# Altium schematic sheet LOGIC_SUPPLY.SchDoc
size A4; SheetNumber: 13; SheetTotal: 17
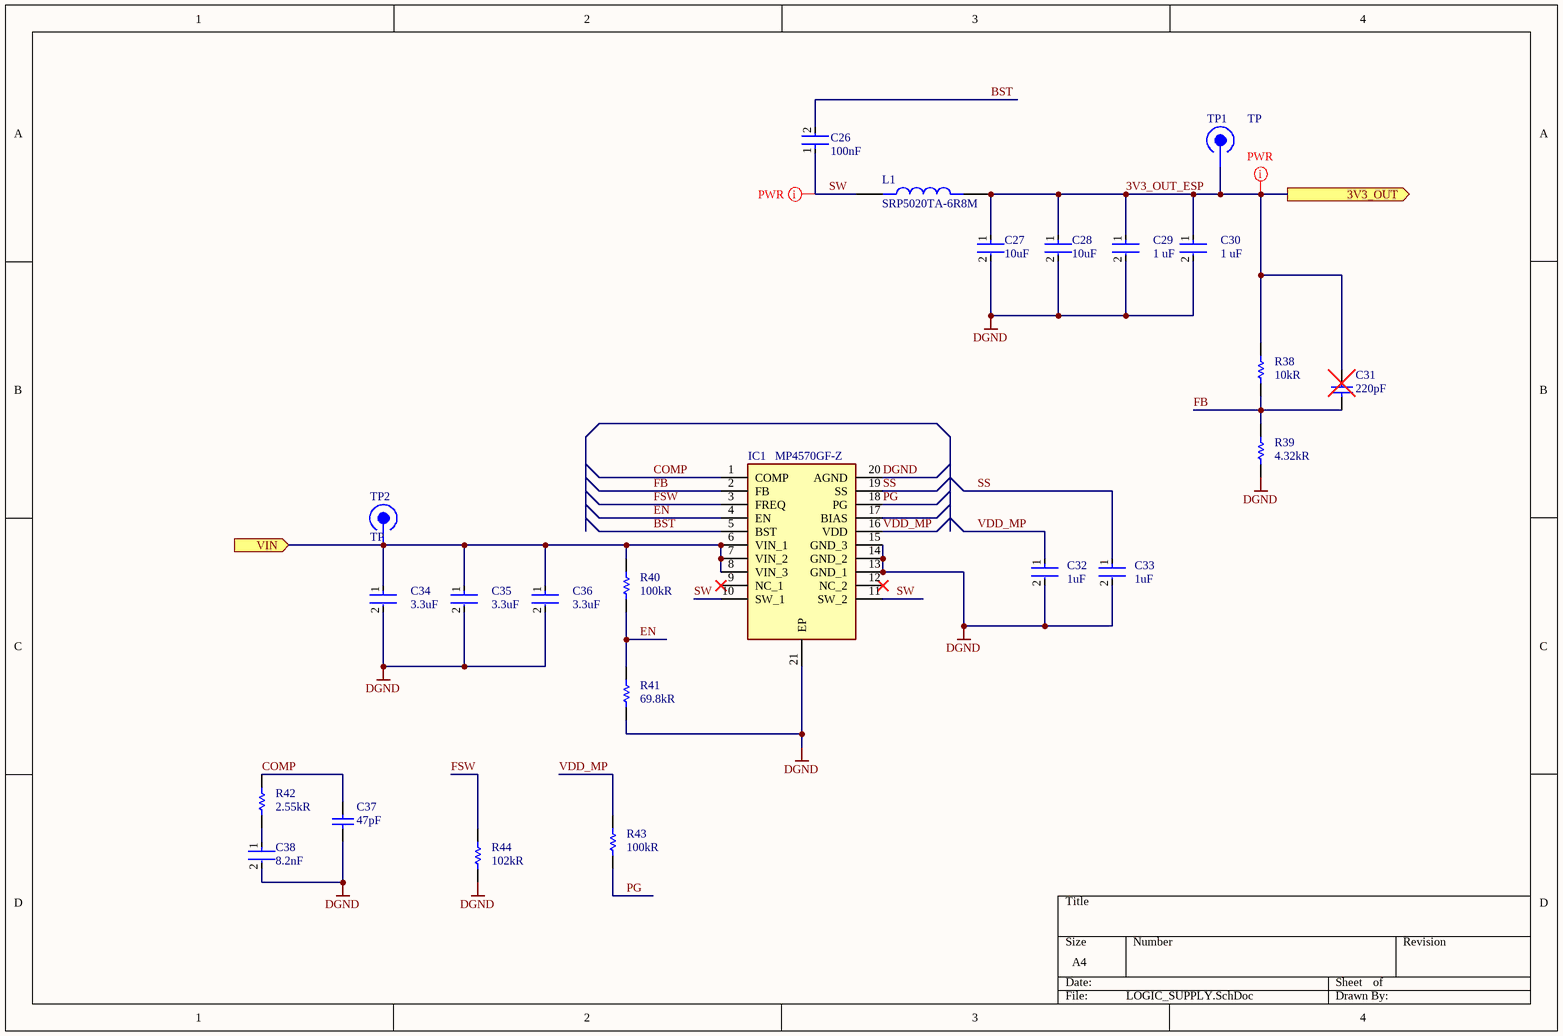
[diagram p0: LOGIC_SUPPLY.SchDoc]

## Parts
C26  value 100nF  [FP-CC0402-IPC_B]  (hidden comment: CC0402KRX7R9BB104)
C27  value 10uF  [FP-GRM21B-0_15-MFG]  (hidden comment: GRM21BR71A106KA73L)
C28  value 10uF  [FP-GRM21B-0_15-MFG]  (hidden comment: GRM21BR71A106KA73L)
C29  value 1 uF  [FP-CC0402-MFG]  (hidden comment: CC0402KRX5R6BB105)
C30  value 1 uF  [FP-CC0402-MFG]  (hidden comment: CC0402KRX5R6BB105)
C31  value 220pF  [CAPC1005X55X25LL05T10]  (hidden comment: GRM1555C1H221GA01J)  (no BOM)
C32  Capacitance: 1uF  [FP-GRM155-0_05-IPC_B]  (hidden comment: GRM155R61E105KA12D)
C33  Capacitance: 1uF  [FP-GRM155-0_05-IPC_B]  (hidden comment: GRM155R61E105KA12D)
C34  value 3.3uF  [FP-C2012-125-0_2-MFG]  (hidden comment: C2012X7R1E335K125AB)
C35  value 3.3uF  [FP-C2012-125-0_2-MFG]  (hidden comment: C2012X7R1E335K125AB)
C36  value 3.3uF  [FP-C2012-125-0_2-MFG]  (hidden comment: C2012X7R1E335K125AB)
C37  value 47pF  [CAPC1005X55X25LL05T10]  (hidden comment: GRM1555C1H470GA01D)
C38  value 8.2nF  [FP-GRM155-0_15-IPC_C]  (hidden comment: GRM1555C1H822JE01D)
IC1  MP4570GF-Z  [MP4570GF-Z-Footprint-1]
L1  SRP5020TA-6R8M  [SRP5020TA-6R8M-Footprint-1]
R38  value 10kR  [RESC1005X40X25LL10T10]  (hidden comment: RK73H1ETTP1002F)
R39  value 4.32kR  [RESC1005X40X25LL10T10]  (hidden comment: RK73H1ETTP4321F)
R40  value 100kR  [RESC1005X40X25NL10T10]  (hidden comment: RK73H1ETTP1003F)
R41  value 69.8kR  [RESC1005X40X25NL10T10]  (hidden comment: RK73H1ETTP6982F)
R42  value 2.55kR  [RESC1005X40X25ML10T10]  (hidden comment: RK73H1ETTP2551F)
R43  value 100kR  [RESC1005X40X25LL10T10]  (hidden comment: RK73H1ETTP1003F)
R44  value 102kR  [RESC1005X40X25ML10T10]  (hidden comment: RK73H1ETTP1023F)
TP1  TP  [TP-Footprint-1]
TP2  TP  [TP-Footprint-1]

## Ports
3V3_OUT (out), VIN (in)

## Nets
DGND: C27.2 C28.2 C29.2 C30.2 C32.2 C33.2 C34.2 C35.2 C36.2 C37.1 C38.2 IC1.13(GND_1) IC1.14(GND_2) IC1.15(GND_3) IC1.20(AGND) IC1.21(EP) R39.1 R41.1 R44.1
3V3_OUT_ESP: C27.1 C28.1 C29.1 C30.1 C31.2 L1.2 R38.2 TP1.1 ; port 3V3_OUT
BST: C26.2 IC1.5(BST)
COMP: C37.2 IC1.1(COMP) R42.2
EN: IC1.4(EN) R40.1 R41.2
FB: C31.1 IC1.2(FB) R38.1 R39.2
FSW: IC1.3(FREQ) R44.2
PG: IC1.18(PG) R43.1
SS: C33.1 IC1.19(SS)
SW: C26.1 IC1.10(SW_1) IC1.11(SW_2) L1.1
VDD_MP: C32.1 IC1.16(VDD) R43.2
VIN: C34.1 C35.1 C36.1 IC1.6(VIN_1) IC1.7(VIN_2) IC1.8(VIN_3) R40.2 TP2.1 ; port VIN
NetC38_1: C38.1 R42.1

Not connected (* = marked no-connect by the designer): IC1 9(NC_1)* 12(NC_2)* 17(BIAS)

## Layout directives
net class PWR: 3V3_OUT_ESP, SW

## Library data of the parts
C26 = CMP-x00152-1: Ceramic Capacitor, Multilayer, Ceramic, 50V, 10% +Tol, 10% -Tol, X7R, 15% TC, 0.1uF, Surface Mount, 0402
C27 C28 = CMP-x00157-1: Ceramic Capacitor, Multilayer, Ceramic, 10V, 10% +Tol, 10% -Tol, X7R, 15% TC, 10uF, Surface Mount, 0805
C29 C30 = CMP-03422-000489-1: CAP CER 1UF 10V X5R 0402; Manufacturer: YAGEO; Temperature Coefficient: 30ppm/°C; Tolerance: 0.1; Automotive Grade: NA; Material: Ceramic; Device Class L1: Passive Components; Ipc Land Pattern Name: CAPC10050X50; Height: 0.55mm; Voltage Rating: 10 V; Digikey Description: CAP CER 1UF 10V X5R 0402; RoHS: TRUE; Temperature: -55°C to +125°C; Octopart: https://octopart.com/cc0402krx5r6bb105-yageo-42244620; Mouser Description: Multilayer Ceramic Capacitors MLCC - SMD/SMT 1uF 10V X5R 10%; Manufacturer Part Number: CC0402KRX5R6BB105; Temperature Characteristic: X5R; Category: Cap; Automotive: No; Temperature Range Low: -55°C; ComponentLink2Description: Datasheet; Temperature Range High: +125°C; Package: CC0402; Capacitance: 1 uF; Footprint Url: http://www.yageo.com/exep/pages/download/literatures/UPY-C_GEN_24.pdf; ComponentLink2URL: http://www.yageo.com/documents/recent/UPY-GP_NP0_16V-to-50V_16.pdf; Lead Free: Yes; Device Class L3: Ceramic Capacitors; Device Class L2: Capacitors
C31 = CMP-2008-04169-1: Manufacturer: Murata; Part Number: GRM1555C1H221GA01J
C32 C33 = CMP-2008-04581-2: Chip Multilayer Ceramic Capacitors for General Purpose, 0402, 1.0uF, X5R, 15%, 10%, 25V; Height: 0.5mm; Voltage: 25V; Tolerance: 10%; Termination: SMD/SMT; Dielectric: X5R; REACH SVHC: No SVHC; Case Code (Imperial): 0402; Max Operating Temperature: 85°C; Lead Free: Lead Free; Case/Package: 0402; Mount: Surface Mount; Width: 0.5mm; Weight: 0.000212oz; Min Operating Temperature: -55°C; Voltage Rating (DC): 25V; Length: 1mm; Thickness: 0.022inch; Voltage Rating: 25V; Material: Ceramic; Case Code (Metric): 1005; Package Quantity: 10000; Packaging: Tape and Reel; Depth: 0.5mm
C34-C36 = CMP-08246-006023-1: Multilayer Ceramic Capacitors 3.3μF ±10% 25V X7R SMD 0805; Height: 1.25mm; Resistor Type: Ceramic; Width: 0.049inch; Length: 2mm; Series: C; Weight: 0.000194oz; Mount: Surface Mount; Tolerance: 10%; Construction: Flat; Case Code (Imperial): 0805; Voltage Rating (DC): 25V; Package Quantity: 1; Lead Free: Lead Free; Voltage Rating: 25V; RoHS Compliant: Yes; Radiation Hardening: No; Case Code (Metric): 2012; REACH SVHC: No SVHC; Dielectric Material: Ceramic; Depth: 1.25mm; Packaging: Tape and Reel; Min Operating Temperature: -55°C; Thickness: 0.057inch; Max Operating Temperature: 125°C; Termination: SMD/SMT; Dielectric: X7R; Case/Package: 0805
C37 = CMP-2008-04366-1: Manufacturer: Murata; Part Number: GRM1555C1H470GA01D
C38 = CMP-06035-016894-1: Chip Multilayer Ceramic Capacitors for General Purpose, 0402, 8200pF, C0G, 30ppm/°C, 5%, 50V
IC1 = CMP-001-0077-1: Switching Voltage Regulators 3A,4.5V-55V Input, Freqcy Programmable; Vendor: Mouser; Category: Integrated Circuit; Package: TSSOP-EP-20; Price: $2.09
L1 = CMP-x00175-1: General Purpose Inductor, 6.8uH, 20%, 1 Element, Metal Alloy Powder-Core, SMD, 2220; Value: 6.8uH
R38 = CMP-x00150-1: Fixed Resistor, Metal Glaze/thick Film, 0.1W, 10000ohm, 75V, 1% +/-Tol, 100ppm/Cel, Surface Mount, 0402
R39 = CMP-2002-04376-1: Part Number: RK73H1ETTP33R2F; Manufacturer: KOA Speer
R40 R43 = CMP-x00162-1: Fixed Resistor, Metal Glaze/thick Film, 0.1W, 100000ohm, 75V, 1% +/-Tol, 100ppm/Cel, Surface Mount, 0402
R41 = CMP-2002-04506-1: Manufacturer: KOA Speer; Part Number: RK73H1ETTP6982F
R42 = CMP-2002-04318-1: Manufacturer: KOA Speer; Part Number: RK73H1ETTP2551F
R44 = CMP-2002-04177-1: Manufacturer: KOA Speer; Part Number: RK73H1ETTP1023F
TP1 TP2 = CMP-001-0086-3: digital shovel test point